# EAGLE design Gateway_v1.0 (EAGLE 9.3.0)

## Sheet 1 of 2
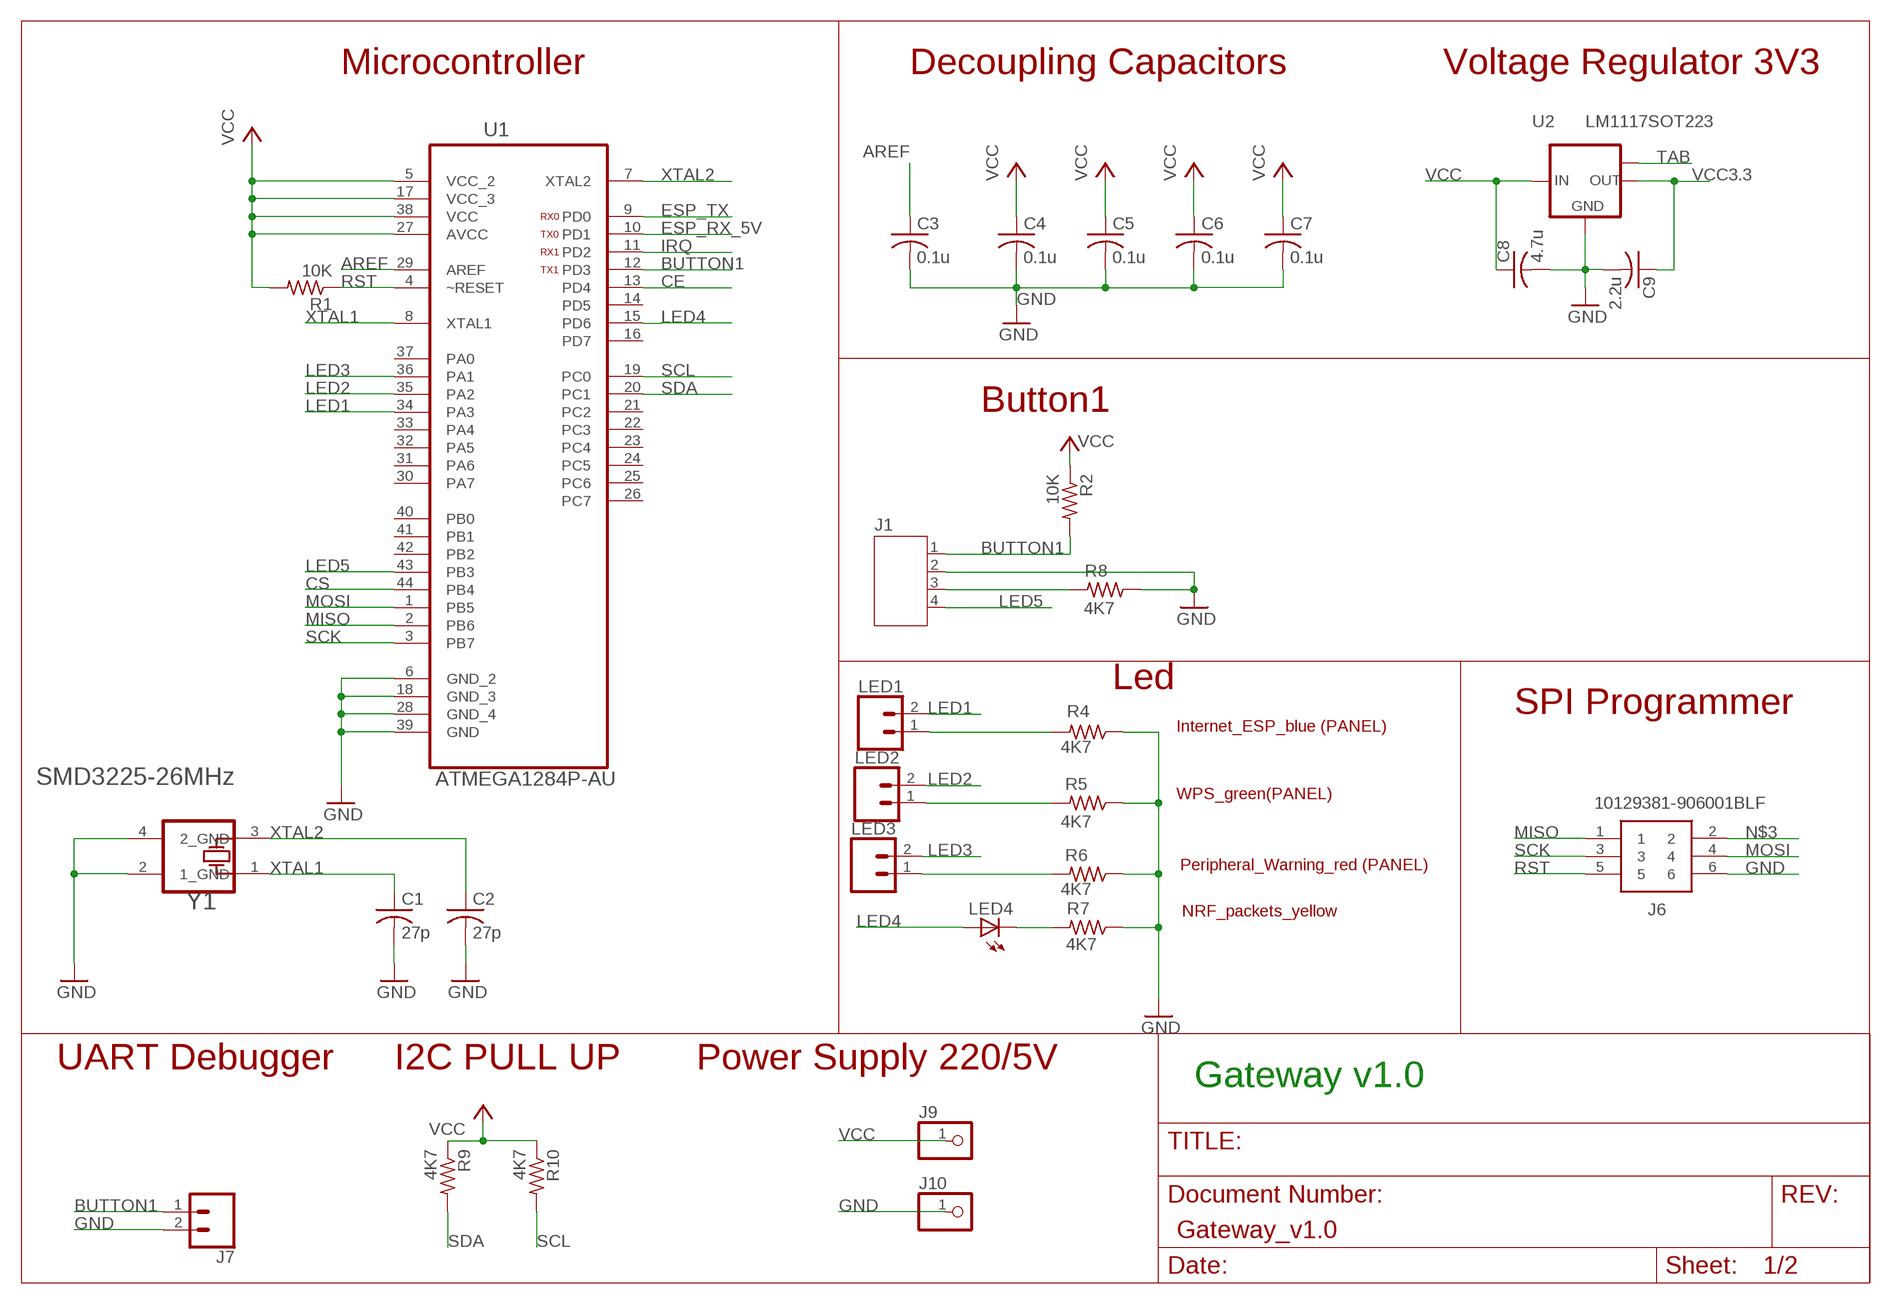
[diagram p0: schematic, sheet 1]

### Parts
C1  27p  CAPACITOR-SMD-0805  [SMD-0805]
C2  27p  CAPACITOR-SMD-0805  [SMD-0805]
C3  0.1u  CAPACITOR-SMD-0805  [SMD-0805]
C4  0.1u  CAPACITOR-SMD-0805  [SMD-0805]
C5  0.1u  CAPACITOR-SMD-0805  [SMD-0805]
C6  0.1u  CAPACITOR-SMD-0805  [SMD-0805]
C7  0.1u  CAPACITOR-SMD-0805  [SMD-0805]
C8  4.7u  CAPACITOR-SMD-0805  [SMD-0805]
C9  2.2u  CAPACITOR-SMD-0805  [SMD-0805]
J1  JST-PH4  [JST-PH4]
J6  10129381-906001BLF  [HDRV6W67P254_2X3_762X483X858P]
J7  CONN_02  [1X02]
J9  PINHD-1X1CB  [1X01-CLEANBIG]
J10  PINHD-1X1CB  [1X01-CLEANBIG]
LED1  CONN_02  [1X02]
LED2  CONN_02  [1X02]
LED3  CONN_02  [1X02]
LED4  LED4  LED-SMD-0805  [SMD-0805-LED]
R1  10K  RESISTOR-SMD-0805  [SMD-0805]
R2  10K  RESISTOR-SMD-0805  [SMD-0805]
R4  4K7  RESISTOR-SMD-0805  [SMD-0805]
R5  4K7  RESISTOR-SMD-0805  [SMD-0805]
R6  4K7  RESISTOR-SMD-0805  [SMD-0805]
R7  4K7  RESISTOR-SMD-0805  [SMD-0805]
R8  4K7  RESISTOR-SMD-0805  [SMD-0805]
R9  4K7  RESISTOR-SMD-0805  [SMD-0805]
R10  4K7  RESISTOR-SMD-0805  [SMD-0805]
U1  ATMEGA1284P-AU  [QFP80P1200X1200X120-44N]
U2  LM1117SOT223  LM1117MPX-3.3  [SOT223]
Y1  TND_ELECTRONIC_SMD3225-26MHZTND_ELECTRONIC_SMD3225-26MHZ_0_0  [TND_ELECTRONIC_SMD3225-26MHZ_0]

### Nets
AREF: C3.1 U1.29(AREF)
BUTTON1: J1.1 J7.1 R2.2 U1.12(PD3)
CE: U1.13(PD4) ; also sheet 2
CS: U1.44(PB4) ; also sheet 2
ESP_RX_5V: U1.10(PD1) ; also sheet 2
ESP_TX: U1.9(PD0) ; also sheet 2
GND: C1.2 C2.2 C3.2 C4.2 C5.2 C6.2 C7.2 C8.2 C9.2 J1.2 J6.6 J7.2 J10.1 R4.1 R5.1 R6.1 R7.1 R8.1 U1.6(GND_2) U1.18(GND_3) U1.28(GND_4) U1.39(GND) U2.1(GND) Y1.2(1_GND) Y1.4(2_GND) ; also sheet 2
IRQ: U1.11(PD2) ; also sheet 2
LED1: LED1.2 U1.34(PA3)
LED2: LED2.2 U1.35(PA2)
LED3: LED3.2 U1.36(PA1)
LED4: LED4.1(A) U1.15(PD6)
LED5: J1.4 U1.43(PB3)
MISO: J6.1 U1.2(PB6) ; also sheet 2
MOSI: J6.4 U1.1(PB5) ; also sheet 2
N$1: LED2.1 R5.2
N$2: LED3.1 R6.2
N$3: J6.2
N$4: LED1.1 R4.2
N$8: J1.3 R8.2
N$12: LED4.2(C) R7.2
RST: J6.5 R1.1 U1.4(~RESET)
SCK: J6.3 U1.3(PB7) ; also sheet 2
SCL: R10.2 U1.19(PC0) ; also sheet 2
SDA: R9.2 U1.20(PC1) ; also sheet 2
VCC: C4.1 C5.1 C6.1 C7.1 C8.1 J9.1 R1.2 R2.1 R9.1 R10.1 U1.5(VCC_2) U1.17(VCC_3) U1.27(AVCC) U1.38(VCC) U2.3(IN) ; also sheet 2
VCC3.3: C9.1 U2.2(OUT) ; also sheet 2
XTAL1: C1.1 U1.8(XTAL1) Y1.1(X1)
XTAL2: C2.1 U1.7(XTAL2) Y1.3(X2)
ΤΑΒ: U2.TAB(OUT1)
Unconnected: U1.14(PD5) U1.16(PD7) U1.21(PC2) U1.22(PC3) U1.23(PC4) U1.24(PC5) U1.25(PC6) U1.26(PC7) U1.30(PA7) U1.31(PA6) U1.32(PA5) U1.33(PA4) U1.37(PA0) U1.40(PB0) U1.41(PB1) U1.42(PB2)

### Notes on the sheet
- Microcontroller | Decoupling Capacitors | Voltage Regulator 3V3
- RX0
- TX0
- RX1
- TX1
- Button1
- Led
- SPI Programmer
- Internet_ESP_blue (PANEL)
- WPS_green(PANEL)
- Peripheral_Warning_red (PANEL)
- NRF_packets_yellow
- UART Debugger | I2C PULL UP | Power Supply 220/5V
- Gateway v1.0

## Sheet 2 of 2
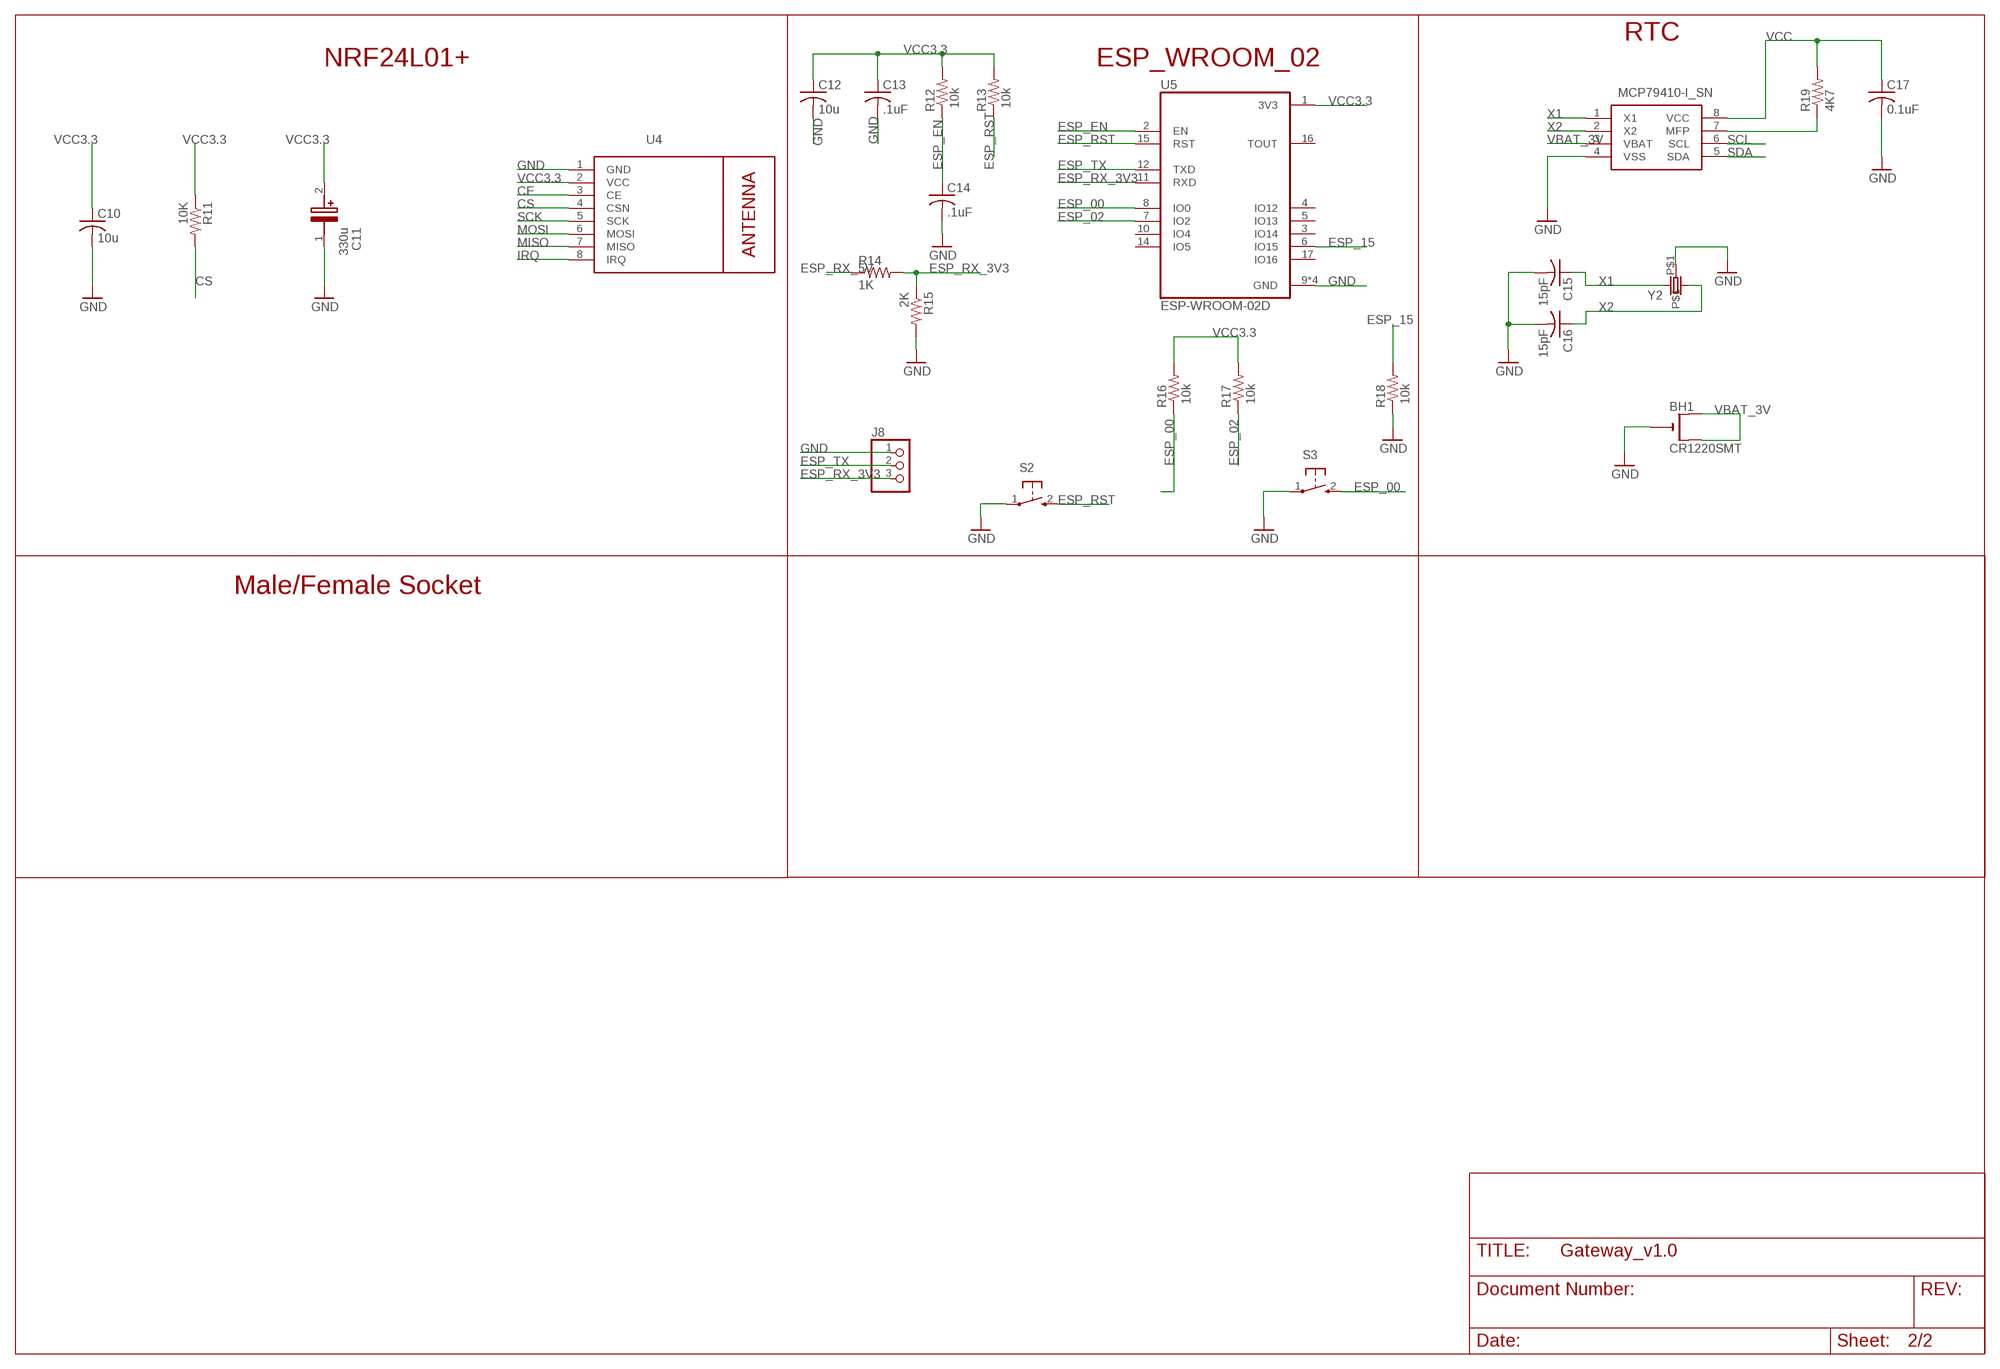
[diagram p1: schematic, sheet 2]

### Parts
BH1  CR1220SMT  [CR1220-SMD]
C10  10u  CAPACITOR-SMD-0805  [SMD-0805]
C11  330u  EEE-FNC271XUP  [SMD_LYTIC_D8]
C12  10u  CAPACITOR-SMD-0805  [SMD-0805]
C13  .1uF  CAPACITOR-SMD-0805  [SMD-0805]
C14  .1uF  CAPACITOR-SMD-0805  [SMD-0805]
C15  15pF  CAPACITOR-SMD-0805  [SMD-0805]
C16  15pF  CAPACITOR-SMD-0805  [SMD-0805]
C17  0.1uF  CAPACITOR-SMD-0805  [SMD-0805]
J8  PINHD-1X3  [1X03]
R11  10K  RESISTOR-SMD-0805  [SMD-0805]
R12  10k  RESISTOR-SMD-0805  [SMD-0805]
R13  10k  RESISTOR-SMD-0805  [SMD-0805]
R14  1K  RESISTOR-SMD-0805  [SMD-0805]
R15  2K  RESISTOR-SMD-0805  [SMD-0805]
R16  10k  RESISTOR-SMD-0805  [SMD-0805]
R17  10k  RESISTOR-SMD-0805  [SMD-0805]
R18  10k  RESISTOR-SMD-0805  [SMD-0805]
R19  4K7  RESISTOR-SMD-0805  [SMD-0805]
S2  SPST_TACT-KMR2  [KMR2]
S3  SPST_TACT-KMR2  [KMR2]
U4  WIRELESS-NRF24L01  [WIRELESS-NRF24L01]
U5  ESP-WROOM-02D  [MODULE_ESP-WROOM-02D]
U6  MCP79410-I_SN  [SOIC127P600X175-8N]
Y2  CRYSTALTC26H  [TC26H]

### Nets
CE: U4.3(CE) ; also sheet 1
CS: R11.2 U4.4(CSN) ; also sheet 1
ESP_00: R16.1 S3.2(S) U5.8(IO0)
ESP_02: R17.1 U5.7(IO2)
ESP_15: R18.2 U5.6(IO15)
ESP_EN: C14.1 R12.1 U5.2(EN)
ESP_RST: R13.1 S2.2(S) U5.15(RST)
ESP_RX_3V3: J8.3 R14.2 R15.1 U5.11(RXD)
ESP_RX_5V: R14.1 ; also sheet 1
ESP_TX: J8.2 U5.12(TXD) ; also sheet 1
GND: BH1.- C10.2 C11.1 C12.2 C13.2 C14.2 C15.2 C16.2 C17.2 J8.1 R15.2 R18.1 S2.1(P) S3.1(P) U4.1(GND) U5.9(GND) U5.13(GND) U5.18(GND) U5.19(GND) U6.4(VSS) Y2.P$1 ; also sheet 1
IRQ: U4.8(IRQ) ; also sheet 1
MISO: U4.7(MISO) ; also sheet 1
MOSI: U4.6(MOSI) ; also sheet 1
N$16: R19.1 U6.7(MFP)
SCK: U4.5(SCK) ; also sheet 1
SCL: U6.6(SCL) ; also sheet 1
SDA: U6.5(SDA) ; also sheet 1
VBAT_3V: BH1.+$1(+) BH1.+$2(+1) U6.3(VBAT)
VCC: C17.1 R19.2 U6.8(VCC) ; also sheet 1
VCC3.3: C10.1 C11.2 C12.1 C13.1 R11.1 R12.2 R13.2 R16.2 R17.2 U4.2(VCC) U5.1(3V3) ; also sheet 1
X1: C15.1 U6.1(X1) Y2.2
X2: C16.1 U6.2(X2) Y2.1
Unconnected: U5.3(IO14) U5.4(IO12) U5.5(IO13) U5.10(IO4) U5.14(IO5) U5.16(TOUT) U5.17(IO16)

### Notes on the sheet
- RTC
- NRF24L01+ | ESP_WROOM_02
- Male/Female Socket

## Library data of the parts
BH1 = CR1220:CR1220: CR1216/CR1220/CR1225 12mm 3V lithium coin cell Great for battery packup. Both SMT and THM holders. Note the THM package has the ground pads on both sides of the PCB so that the masks are the same - this reduces the cost Check prices <https://pricing.snapeda.com/parts/CR1220/FDK%20America%2C/view-part?ref=eda>; AVAILABILITY: In Stock; DESCRIPTION: Button cell battery, Lithium, 3 V, 35 mAh | VARTA CR1220 (Button cell battery, Lithium, 3 V, 35 mAh Standard Batteries).; MF: FDK America,; MP: CR1220; PACKAGE: Varta; PRICE: None
C1-C10 C12-C17 = Fuzzy:CAPACITOR-SMD-0805
C11 = SamacSys_Parts:EEE-FNC271XUP: PANASONIC - EEE-FNC271XUP - CAP, 270UF, 16V, ALU ELEC, SMD Source: Datasheet <http://industrial.panasonic.com/cdbs/www-data/pdf/RDE0000/RDE0000C1259.pdf>; DESCRIPTION: PANASONIC - EEE-FNC271XUP - CAP, 270UF, 16V, ALU ELEC, SMD; HEIGHT: 7.8mm; MANUFACTURER_NAME: Panasonic; MANUFACTURER_PART_NUMBER: EEE-FNC271XUP; MOUSER_PART_NUMBER: 667-EEE-FNC271XUP; MOUSER_PRICE-STOCK: https://www.mouser.co.uk/ProductDetail/Panasonic/EEE-FNC271XUP?qs=OlC7AqGiEDk4Wtbs6TVCqQ%3D%3D
J1 = jst-ph:JST-PH4
J6 = SamacSys_Parts:10129381-906001BLF: HEADER DR VT TH 2X3 Source: Datasheet <https://cdn.amphenol-icc.com/media/wysiwyg/files/drawing/10129381.pdf>; DESCRIPTION: HEADER DR VT TH 2X3; HEIGHT: 8.58mm; MANUFACTURER_NAME: Amphenol; MANUFACTURER_PART_NUMBER: 10129381-906001BLF; MOUSER_PART_NUMBER: 649-1012938190601BLF; MOUSER_PRICE-STOCK: https://www.mouser.co.uk/ProductDetail/Amphenol-FCI/10129381-906001BLF?qs=0lQeLiL1qyZMxGRnx95Mzg%3D%3D
J7 LED1-LED3 = SparkFun-Connectors:CONN_02: Multi connection point. Often used as Generic Header-pin footprint for 0.1 inch spaced/style header connections On any of the 0.1 inch spaced packages, you can populate with these: Break Away Headers - Straight <https://www.sparkfun.com/products/116> (PRT-00116) Break Away Male Headers - Right Angle <https://www.sparkfun.com/products/553> (PRT-00553) Female Headers <https://www.sparkfun.com/products/115> (PRT-00115) Break Away Headers - Machine Pin <https://www.sparkfun.com/products/117> (PRT-00117) Break Away Female Headers - Swiss Machine Pin <https://www.sparkfun.com/products/743> (PRT-00743) For SCREWTERMINALS and SPRING TERMINALS visit here: Screw Terimnals on SparkFun.com <https://www.sparkfun.com/search/results?term=Screw+Terminals> (5mm/3.5mm/2.54mm spacing) This device is also useful as a general connection point to wire up your design to another part of your project. Our various solder wires solder well into these plated through hole pads. Hook-Up Wire - Assortment (Stranded, 22 AWG) <https://www.sparkfun.com/products/11375> (PRT-11375) Hook-Up Wire - Assortment (Solid Core, 22 AWG) <https://www.sparkfun.com/products/11367> (PRT-11367) View the entire wire category on our website here <https://www.sparkfun.com/categories/141> Special notes: Molex polarized connector foot print use with: PRT-08233 with associated crimp pins and housings. 2.54_SCREWTERM for use with PRT-10571. 3.5mm Screw Terminal footprints for PRT-08084 5mm Screw Terminal footprints for use with PRT-08432
J8 = adafruit:PINHD-1X3: PIN HEADER
J9 J10 = adafruit:PINHD-1X1: Pin header 1x1 for 0.1" spacing With round pins
LED4 = Fuzzy:LED-SMD-0805
R1 R2 R4-R19 = Fuzzy:RESISTOR-SMD-0805
S2 S3 = TS-1096S-A2B2-C1D2:SPST_TACT: SMT 6mm switch, EVQQ2 series http://www.ladyada.net/library/eagle
U1 = ATMEGA1284P-AU:ATMEGA1284P-AU: Microcontroller with Programmable Flash; AVAILABILITY: Unavailable; DESCRIPTION: MCU 8-Bit ATmega AVR RISC 128KB Flash 2.5V/3.3V/5V 44-Pin TQFP; MF: Microchip; MP: ATMEGA1284P-AU; PACKAGE: TQFP-44 Microchip; PRICE: None
U2 = lm1117:LM1117MPX-*
U4 = diy-modules:WIRELESS-NRF24L01: 2.4 GHz Wireless Module based on NRF24L01 chip More details available here: http://www.electrodragon.com/w/NRF24L01 Click here to find device on ebay.com <http://www.ebay.com/sch/nrf24l01+arduino>
U5 = ESP-WROOM-02D:ESP-WROOM-02D: WiFi 802.11b/g/n Transceiver Module 2.4GHz ~ 2.5GHz Integrated, Trace Surface Mount Check prices <https://pricing.snapeda.com/parts/ESP-WROOM-02D/Espressif%20Systems/view-part?ref=eda>; AVAILABILITY: In Stock; DESCRIPTION: WiFi 802.11b/g/n Transceiver Module 2.4GHz ~ 2.5GHz Integrated, Trace Surface Mount; MF: Espressif Systems; MP: ESP-WROOM-02D; PACKAGE: SMD-18 Espressif Systems; PRICE: None; PURCHASE-URL: https://pricing.snapeda.com/search/part/ESP-WROOM-02D/?ref=eda
U6 = SamacSys_Parts:MCP79410-I_SN: I2C GP RTCC, 1Kb EE, 64B SRAM, ID Source: Datasheet <https://componentsearchengine.com/Datasheets/1/MCP79410-I_SN.pdf>; DESCRIPTION: I2C GP RTCC, 1Kb EE, 64B SRAM, ID; HEIGHT: 1.75mm; MANUFACTURER_NAME: Microchip; MANUFACTURER_PART_NUMBER: MCP79410-I/SN; MOUSER_PART_NUMBER: 579-MCP79410-I/SN; MOUSER_PRICE-STOCK: https://www.mouser.com/Search/Refine.aspx?Keyword=579-MCP79410-I%2FSN
Y1 = TND Electronic - SMD3225-26MHz:TND_ELECTRONIC_SMD3225-26MHZ: TXTF-XTAL_1-3-4; ADJUSTMENT_TOLERANCE_MAX: +/- 20 ppm; CIIVA_IDS: 21167266; COMPONENT_LINK_1_DESCRIPTION: Manufacturer URL; COMPONENT_LINK_1_URL: http://www.txtianfeng.cn/; DATASHEET_VERSION: Dec-13; EQUIVALENT_SERIES_RESISTANCE_AT_25_DEGC_MAX: 50 Ohm; FOOTPRINT_VARIANT_NAME_0: Manufacturer Recommended; IMPORTED: yes; IMPORTED_FROM: vault; IMPORT_TS: 1521862708; LOAD_CAPACITANCE: 15 pF; MF: TND Electronic; MOUNTING_TECHNOLOGY: Surface Mount; MPN: SMD3225-26MHz; NOMINAL_FREQUENCY: 26 MHz; OPERATING_TEMPERATURE_RANGE: -20 to 70 degC; PACKAGE: SMD3225-4; PACKAGE_DESCRIPTION: 4-Pin Surface Mount Crystal, Body 2.5 x 3.2 mm, Height 0.7 mm; PREFIX: X; RELEASE_DATE: 1387507933; SHUNT_CAPACITANCE_MAX: 3.5 pF; TOLERANCE_OVER_THE_TEMPERATURE_RANGE_MAX: +/- 20 ppm; VAULT_GUID: 2DF3794C-1672-4F1A-ABBC-3B8CD58D4AF4; VAULT_REVISION: 393B1630-2FB9-4E5C-9BF1-9404DCAA7C1D
Y2 = adafruit:CRYSTAL: CRYSTAL; OC_FARNELL: unknown; OC_NEWARK: unknown

## Net classes
0 default: width 0.254 mm, drill 0.508 mm, clearance 0.203 mm
1 ACnet: width 1.778 mm, drill 0.508 mm, clearance 0.203 mm

## Board
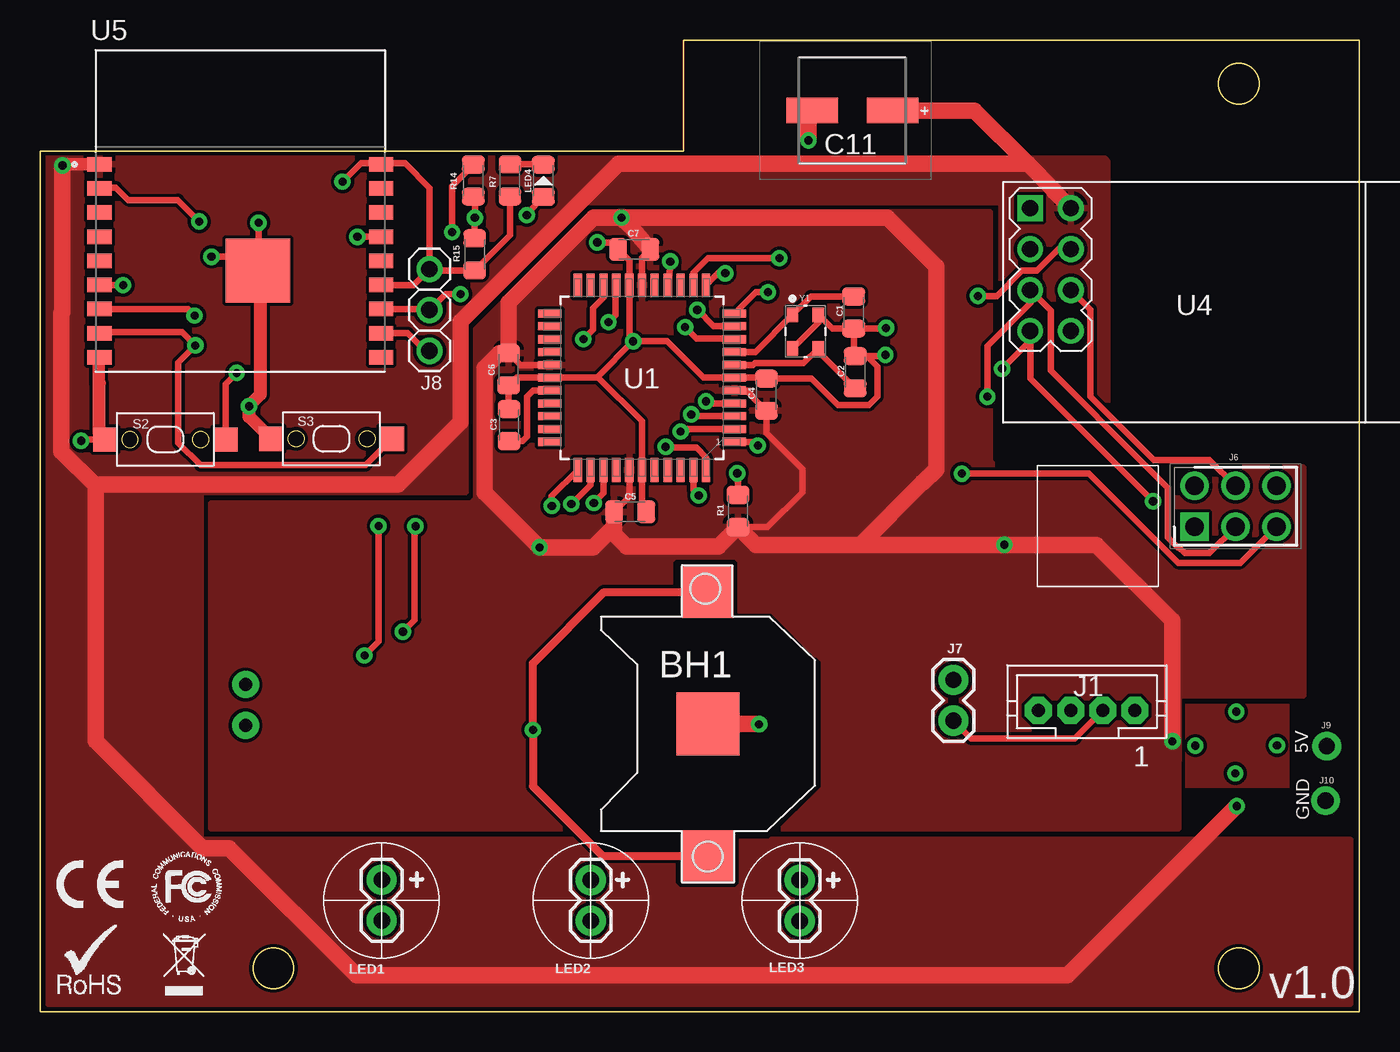
[diagram p2: board, top side]
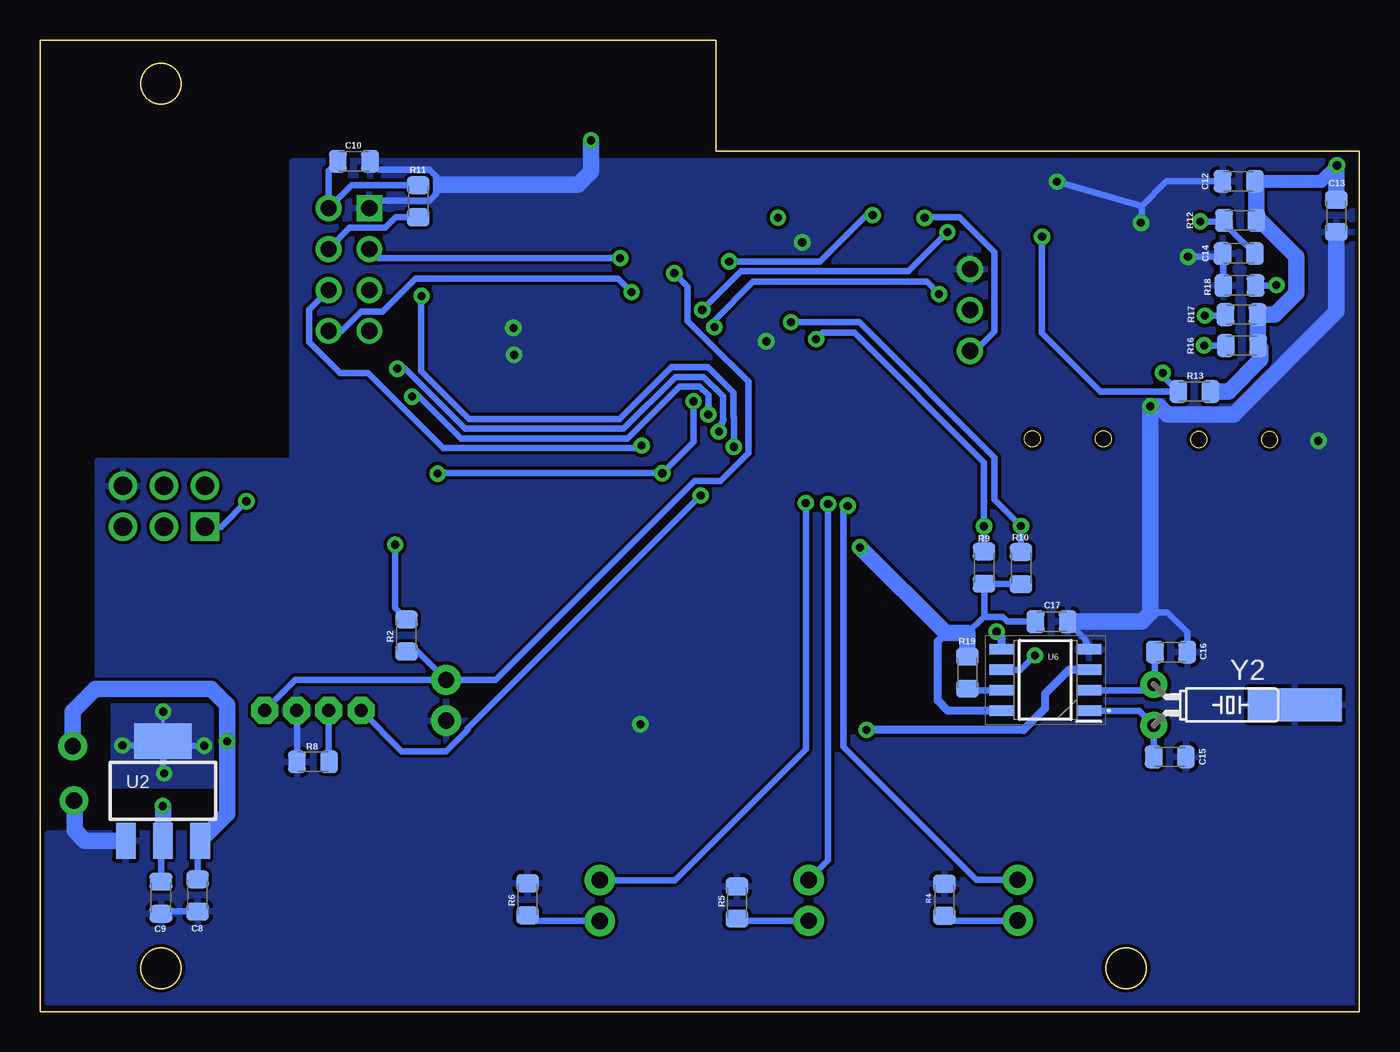
[diagram p3: board, bottom side, seen from below]

Size 82 x 60.4 mm. Coordinates in mm from the lower left corner, seen from the top.
Outline: 0,0 82,0 82,60.4 40,60.4 40,53.5 0,53.5 0,0
Outline: circle at 74.5,2.7 radius 1.25
Outline: circle at 14.5,2.7 radius 1.25
Outline: circle at 74.5,57.7 radius 1.25
Copper layers (1*16): Top 0.035mm / dielectric 1.5mm / Bottom 0.035mm
Design rules "SparkFun": minimum track width 8mil, minimum drill 20mil, track to track 8mil, track to pad 8mil, pad to pad 8mil, via to via 8mil, smd to smd 8mil, copper to edge 8mil, drill to drill 8mil, minimum pad ring 12mil, minimum via ring 10mil, stop-mask expansion 4mil, vias tented up to drill 20mil, thermal gap 10mil

### Footprints (pad centres in the part's own frame; a part is rotated, then mirrored left to right if it is on the bottom)
CR1220-SMD = smd 3.2 x 3.2: +$1 -8.2,0; +$2 8.2,0 | smd 3.9 x 3.9: - 0,0
SMD-0805 = smd 1.1 x 1.4: 1 -1,0; 2 1,0
SMD_LYTIC_D8 = smd 3.2 x 1.6: 1 -2.5,0; 2 2.5,0
JST-PH4 = drill 0.813 pad 1.676 octagon: 1 3,0; 2 1,0; 3 -1,0; 4 -3,0
HDRV6W67P254_2X3_762X483X858P = drill 1.15 pad 1.725 square: 1 0,0 | drill 1.15 pad 1.725: 2 0,2.54; 3 2.54,0; 4 2.54,2.54; 5 5.08,0; 6 5.08,2.54
1X02 = drill 1.016 pad 1.88: 1 0,0; 2 2.54,0
1X03 = drill 1.016: 1 -2.54,0; 2 0,0; 3 2.54,0
1X01-CLEANBIG = drill 1.016 pad 1.778: 1 0,0
SMD-0805-LED = smd 1.1 x 1.4: 1 -1,0; 2 1,0
KMR2 = smd 1.5 x 1.5: 1 -3.75,0; 2 3.75,0
QFP80P1200X1200X120-44N = smd 1.473 x 0.508: 1 -5.74,3.988; 2 -5.74,3.2; 3 -5.74,2.388; 4 -5.74,1.6; 5 -5.74,0.787; 6 -5.74,0; 7 -5.74,-0.787; 8 -5.74,-1.6; 9 -5.74,-2.388; 10 -5.74,-3.2; 11 -5.74,-3.988; 23 5.74,-3.988; 24 5.74,-3.2; 25 5.74,-2.388; 26 5.74,-1.6; 27 5.74,-0.787; 28 5.74,0; 29 5.74,0.787; 30 5.74,1.6; 31 5.74,2.388; 32 5.74,3.2; 33 5.74,3.988 | smd 0.508 x 1.473: 12 -3.988,-5.74; 13 -3.2,-5.74; 14 -2.388,-5.74; 15 -1.6,-5.74; 16 -0.787,-5.74; 17 0,-5.74; 18 0.787,-5.74; 19 1.6,-5.74; 20 2.388,-5.74; 21 3.2,-5.74; 22 3.988,-5.74; 34 3.988,5.74; 35 3.2,5.74; 36 2.388,5.74; 37 1.6,5.74; 38 0.787,5.74; 39 0,5.74; 40 -0.787,5.74; 41 -1.6,5.74; 42 -2.388,5.74; 43 -3.2,5.74; 44 -3.988,5.74
SOT223 = smd 1.219 x 2.235: 1 -2.311,-3.099; 2 0,-3.099; 3 2.311,-3.099 | smd 3.6 x 2.2: TAB 0,3.099
WIRELESS-NRF24L01 = drill 1 square: 1 -12.7,6.35 | drill 1: 2 -10.16,6.35; 3 -12.7,3.81; 4 -10.16,3.81; 5 -12.7,1.27; 6 -10.16,1.27; 7 -12.7,-1.27; 8 -10.16,-1.27
MODULE_ESP-WROOM-02D = smd 1.5 x 0.9: 1 -8.75,2.9; 2 -8.75,1.4; 3 -8.75,-0.1; 4 -8.75,-1.6; 5 -8.75,-3.1; 6 -8.75,-4.6; 7 -8.75,-6.1; 8 -8.75,-7.6; 9 -8.75,-9.1; 10 8.75,-9.1; 11 8.75,-7.6; 12 8.75,-6.1; 13 8.75,-4.6; 14 8.75,-3.1; 15 8.75,-1.6; 16 8.75,-0.1; 17 8.75,1.4; 18 8.75,2.9 | smd 4 x 4: 19 1.1,-3.71
SOIC127P600X175-8N = smd 1.525 x 0.65: 1 -2.712,1.905; 2 -2.712,0.635; 3 -2.712,-0.635; 4 -2.712,-1.905; 5 2.712,-1.905; 6 2.712,-0.635; 7 2.712,0.635; 8 2.712,1.905
TND_ELECTRONIC_SMD3225-26MHZ_0 = smd 0.7 x 0.9: 1 -0.8,1.05; 2 -0.8,-1.05; 3 0.8,-1.05; 4 0.8,1.05
TC26H = drill 0.813 pad 1.676: 1 -1.27,0; 2 1.27,0 | smd 2.032 x 5.842: P$1 0,8.763

### Placement (x,y rotation side)
BH1  41.51,17.89 90 top
C1  50.57,43.47 270 top
C2  50.66,39.76 90 top
C3  29.15,36.47 90 top
C4  45.14,38.36 90 top
C5  36.67,31.08 0 top
C6  29.12,39.94 270 top
C7  36.92,47.4 180 top
C8  72.22,7.23 270 bottom
C9  74.49,7.09 270 bottom
C10  62.5,52.87 0 bottom
C11  50.48,56.03 0 top
C12  7.5,51.63 180 bottom
C13  1.43,49.48 270 bottom
C14  7.49,47.14 180 bottom
C15  11.78,15.84 0 bottom
C16  11.7,22.36 0 bottom
C17  19.13,24.25 0 bottom
J1  65.06,18.73 0 top
J6  71.77,30.15 0 top
J7  56.77,20.63 270 top
J8  24.2,43.63 270 top
J9  79.98,16.5 0 top
J10  79.91,13.13 0 top
LED1  21.23,5.66 90 top
LED2  34.23,5.65 90 top
LED3  47.22,5.64 90 top
LED4  31.28,51.66 90 top
R1  43.38,31.13 270 top
R2  59.23,23.39 270 bottom
R4  25.79,6.96 270 bottom
R5  38.69,6.79 270 bottom
R6  51.7,6.99 270 bottom
R7  29.2,51.68 90 top
R8  65.04,15.54 0 bottom
R9  23.33,27.61 90 bottom
R10  21.03,27.58 90 bottom
R11  58.5,50.39 270 bottom
R12  7.41,49.2 0 bottom
R13  10.25,38.55 0 bottom
R14  26.93,51.67 270 top
R15  27.01,47.09 270 top
R16  7.29,41.41 0 bottom
R17  7.32,43.34 0 bottom
R18  7.45,45.15 0 bottom
R19  24.36,21.08 90 bottom
S2  7.78,35.58 0 top
S3  18.11,35.62 0 top
U1  37.41,39.42 180 top
U2  74.37,13.73 0 bottom
U4  74.24,43.6 0 top
U5  12.44,49.78 0 top
U6  19.52,20.62 180 bottom
Y1  47.57,42.29 0 top
Y2  12.77,19.07 270 bottom

### Tracks (layer width: path | path; a pad name or v marks a point on that pad's centre or on a via)
AREF
  Top 0.406: U1.29 30.64,38.63 30.26,38.25 30.26,35.75 29.98,35.47 C3.1
BUTTON1  (via drill 0.51)
  Top 0.406: v42.58,45.91 42.14,45.91 U1.12
  Bottom 0.406: v42.58,45.91 41.76,45.09 41.76,42.94 40.47,41.65 40.45,41.65 37.97,39.17 37.97,34.75 39.71,33 41.32,33 53.69,20.63 J7.1 | J1.1 66.16,20.63 J7.1 | R2.2 58.53,22.39 J7.1
CE  (via drill 0.51)
  Top 0.406: v45.95,46.85 41.52,46.85 40.61,45.94 U1.13
  Bottom 0.406: v45.95,46.85 60.98,46.85 U4.3
CS  (via drill 0.51)
  Top 0.406: v38.88,35.13 38.94,35.07 40.79,35.07 41.4,34.46 U1.44 | v58.29,44.5 59.46,44.5 61.04,46.08 61.97,46.08 63.3,47.41 U4.4
  Bottom 0.406: v38.88,35.13 38.88,36.95 38.91,36.98 38.91,38.49 40.5,40.08 42.76,40.08 45.98,36.86 55.34,36.86 58.31,39.82 58.31,44.48 v58.29,44.5 | R11.2 59.92,49.39 60.57,48.74 62.75,48.74 U4.4
ESP_00  (via drill 0.51)
  Top 0.406: S3.2 20.22,33.98 9.96,33.98 8.59,35.35 8.59,40.37 v9.64,41.42 8.82,42.24 3.74,42.24 U5.8
  Bottom 0.406: v9.64,41.42 v9.63,41.41 R16.1
ESP_02  (via drill 0.51)
  Top 0.406: v9.59,43.28 9.19,43.68 U5.7
  Bottom 0.406: v9.59,43.28 8.38,43.28 R17.1
ESP_15  (via drill 0.51)
  Top 0.406: U5.6 v5.15,45.17
  Bottom 0.406: R18.2 5.17,45.15 v5.15,45.17
ESP_EN  (via drill 0.51)
  Top 0.406: v9.88,49.13 8.55,50.46 5.48,50.46 4.7,51.24 3.74,51.24 U5.2
  Bottom 0.406: v9.88,49.13 8.11,49.13 8.07,49.17 | R12.1 8.25,49.35 8.07,49.17 | C14.1 8.04,48.66 8.04,49.14 8.07,49.17
ESP_RST  (via drill 0.51)
  Top 0.406: v12.21,39.71 11.53,39.03 S2.2 | v19.72,48.18 U5.15
  Bottom 0.406: v19.72,48.18 19.72,42.18 16.09,38.55 R13.1 12.21,39.51 v12.21,39.71
ESP_RX_3V3  (via drill 0.51)
  Top 0.406: J8.3 23.94,41.09 22.85,42.18 U5.11 | R15.1 v27.01,49.35 v27.02,49.36 27.02,50.58 R14.2
  Bottom 0.406: J8.3 23.87,41.09 22.68,42.28 22.68,47.21 24.86,49.39 26.99,49.39 v27.02,49.36
ESP_RX_5V  (via drill 0.51)
  Top 0.406: v40.85,43.64 41.87,42.62 U1.10 | v25.6,48.47 25.6,51.34 R14.1
  Bottom 0.406: v40.85,43.64 40.82,43.64 38.44,46.03 28.04,46.03 v25.6,48.47
ESP_TX  (via drill 0.51)
  Top 0.406: U1.9 43.1,41.86 40.79,41.86 v40.09,42.56 | v26.12,44.62 25.19,44.62 J8.2 24.09,43.74 24.03,43.68 U5.12
  Bottom 0.406: v26.12,44.62 26.89,45.38 37.69,45.38 40.09,42.98 v40.09,42.56
GND  (via drill 0.51)
  Top 0.406: J8.1 24.28,46.09 R15.2 29.2,48.28 R7.1 | C5.2 37.41,31.34 U1.39 37.41,36.71 34.65,39.47 | C3.2 29.12,37.5 C6.2 29.6,39.42 U1.28 34.6,39.42 34.65,39.47 | v18.79,51.61 19.95,52.77 21.1,52.77 U5.18 21.24,52.74 22.67,52.74 24.2,51.21 J8.1 | 34.65,39.47 v36.86,41.68 | v36.86,41.68 36.62,41.92 U1.18 36.62,46.7 C7.2 35.49,47.83 v34.63,47.83 | C1.2 50.59,42.45 50.59,40.83 C2.2 | Y1.2 48.37,42.84 Y1.4 49.24,42.47 C1.2 | C2.2 51.4,40.76 52.04,40.12 52.04,38.24 51.53,37.73 49.58,37.73 47.95,39.36 C4.2 45.08,39.42 U1.6 41.22,39.42 38.96,41.68 v36.86,41.68 | S2.1 2.63,35.58 v2.54,35.49 | J7.2 57.87,16.99 64.32,16.99 J1.2 | C1.2 52.54,42.47 v52.58,42.51 | C2.2 52.46,40.76 v52.54,40.84 | U5.13 23.21,45.18 J8.1 | v13.57,49.05 13.57,46.84 | 13.57,46.84 13.57,46.11 U5.19 13.68,46.22 13.68,46.42 | v10.65,46.94 13.47,46.94 13.57,46.84
  Top 0.762: 3.65,39.09 3.65,40.65 U5.9
  Top 0.813: 3.65,39.09 3.68,39.06 3.68,35.93 S2.1 | 13.68,46.42 13.68,38.38 12.98,37.68 v12.98,37.64 12.98,37 S3.1
  Top 1.016: BH1.- 44.67,17.89 v44.69,17.87 | v47.76,54.17 47.76,55.81 C11.1
  Bottom 0.406: C12.2 11.98,51.63 13.53,50.08 | U6.4 17.06,23.18 C17.2 | v18.79,51.61 13.53,50.08 | R18.1 8.45,47.1 C14.2 8.7,46.94 v10.65,46.94 | C10.2 60.98,52.35 57.79,52.35 57.39,51.95 57.39,50.83 57.79,50.43 61.06,50.43 U4.1 | C9.2 74.35,6.23 C8.2 | R8.1 66.04,18.71 J1.2 | C16.2 10.7,23.6 11.92,24.82 12.98,24.82 | 13.53,50.08 13.53,49.1 v13.57,49.05
  Bottom 1.016: C13.2 1.43,43.52 7.81,37.14 11.93,37.14 12.43,37.64 v12.98,37.64 12.98,24.82 12.97,24.81 13.53,24.25 C17.2 | J10.1 79.86,13.08 79.86,11.26 79.23,10.63 U2.1 | 57.09,51.41 48.57,51.41 47.76,52.22 v47.76,54.17
  pour Bottom: 0.37,52.89 66.3,52.89 66.3,34.29 66.26,34.25 78.42,34.25 78.43,34.24 78.43,19.94 70.6,19.94 70.6,11.08 81.51,11.08 81.52,11.09 81.57,0.58 0.36,0.58 0.36,52.9
IRQ  (via drill 0.51)
  Top 0.406: U1.11 44.48,44.74 v45.24,44.74
  Bottom 0.406: v45.24,44.74 46.09,45.59 58.67,45.59 60.72,43.54 62.04,43.54 63.25,42.33 U4.8
LED1  (via drill 0.51)
  Top 0.406: U1.34 31.8,32.06 v31.8,31.45
  Bottom 0.406: v31.8,31.45 32.06,31.19 32.06,16.45 23.81,8.2 LED1.2
LED2  (via drill 0.51)
  Top 0.406: U1.35 34.21,32.75 v33.02,31.56
  Bottom 0.406: v33.02,31.56 33.02,9.4 LED2.2
LED3  (via drill 0.51)
  Top 0.406: U1.36 35.02,32.24 v34.41,31.63
  Bottom 0.406: v34.41,31.63 34.41,16.31 42.54,8.18 LED3.2
LED4  (via drill 0.51)
  Top 0.406: U1.15 39.06,45.21 v39.17,46.64 | LED4.1 30.25,49.63 v30.25,49.52
  Bottom 0.406: v39.17,46.64 33.52,46.64 30.64,49.52 v30.25,49.52
LED5  (via drill 0.51)
  Top 0.406: U1.43 40.61,32.42 v40.94,32.09
  Bottom 0.406: v40.94,32.09 55.42,17.61 55.42,17.53 56.77,16.19 59.52,16.19 J1.4
MISO  (via drill 0.51)
  Top 0.406: v39.81,36.07 39.96,36.22 U1.2 | v59.8,39.98 61.54,41.72 U4.7 61.54,39.38 v69.19,31.73
  Bottom 0.406: v39.81,36.07 39.52,36.85 39.56,36.89 39.56,38.27 40.75,39.47 42.51,39.47 45.73,36.25 55.6,36.25 59.32,39.98 v59.8,39.98 | v69.19,31.73 70.77,30.15 J6.1
MOSI  (via drill 0.51)
  Top 0.406: U1.1 44.38,35.43 v44.61,35.2 | U4.6 65.29,43.66 65.29,38.24 69.22,34.31 72.69,34.31 J6.4
  Bottom 0.406: v44.61,35.2 44.78,35.03 56.97,35.03 61.63,39.7 63.35,39.7 65.29,41.63 65.29,43.66 U4.6
N$1
  Bottom 0.406: LED2.1 38.55,5.65 R5.2
N$2
  Bottom 0.406: LED3.1 51.35,5.64 R6.2
N$4
  Bottom 0.406: LED1.1 25.49,5.66 R4.2
N$8
  Bottom 0.406: J1.3 64.06,15.56 R8.2
N$12
  Top 0.406: R7.2 31.26,52.68 LED4.2
N$16
  Bottom 0.406: U6.7 24.27,19.98 R19.1
NONE
  cutout Top: 35.15,24.52 39.55,24.52 39.55,27.87 39.59,27.91 43.1,27.91 43.14,27.87 43.14,24.72 43.24,24.62 43.31,24.55 45.35,24.55 48.08,21.82 48.18,21.82 48.31,21.69 48.31,14.05 45.38,11.12 45.22,10.96 43.31,10.96 43.21,10.86 43.21,8.03 43.14,7.96 39.85,7.96 39.72,8.09 39.72,10.96 34.88,10.96 34.82,11.02 34.82,24.46 34.88,24.52
  cutout Bottom: 17.62,23.27 21.34,23.27 21.4,23.21 21.4,18.24 21.37,18.21 21.34,18.18 17.81,18.18 17.81,23.2 17.85,23.24
RST  (via drill 0.51)
  Top 0.406: v43.33,33.48 43.38,33.43 R1.1 | U1.4 41.51,37.82 v41.38,37.95 | v57.3,33.45 65.2,33.45 70.75,27.9 74.6,27.9 J6.5
  Bottom 0.406: v41.38,37.95 41.38,35.42 v43.33,33.48 57.27,33.48 v57.3,33.45
SCK  (via drill 0.51)
  Top 0.406: U1.3 40.57,37.03 v40.47,37.13 | v58.88,38.24 v58.89,38.24 58.89,41.39 61.54,44.04 U4.5 62.82,43.59 62.82,39.85 68.61,34.06 69.02,33.65 70.1,32.57 70.1,29.49 70.72,28.86 70.79,28.86 71.14,28.51 72.67,28.51 J6.3
  Bottom 0.406: v40.47,37.13 40.47,38.33 41.01,38.86 42.26,38.86 45.48,35.64 55.85,35.64 58.45,38.24 v58.88,38.24
SCL  (via drill 0.51)
  Top 0.406: U1.19 35.77,45.12 35.77,43.31 v35.33,42.87 | v20.16,22.15 21.03,23.02 v21.03,30.2
  Bottom 0.406: v35.33,42.87 31.08,42.87 22.67,34.46 22.67,31.84 v21.03,30.2 R10.2 | U6.6 21.05,21.25 v20.16,22.15
SDA  (via drill 0.51)
  Top 0.406: v33.77,41.82 34.38,42.42 34.38,43.74 35.02,44.39 U1.20 | v22.54,23.63 23.28,24.37 23.28,30.13 v23.33,30.18
  Bottom 0.406: v33.77,41.82 33.37,42.22 31.4,42.22 23.33,34.15 v23.33,30.18 R9.2
  Bottom 0.508: U6.5 22.23,23.32 v22.54,23.63
VBAT_3V  (via drill 0.51)
  Top 0.508: BH1.+$1 34.96,9.69 30.63,14.02 v30.63,17.52 30.63,21.66 35.06,26.09 BH1.+$2
  Bottom 0.508: v30.63,17.52 20.87,17.52 19.54,18.85 19.54,19.76 18.05,21.25 U6.3
VCC  (via drill 0.51)
  Top 0.406: U1.27 29.85,40.21 C6.1 | U1.17 37.41,46.89 C7.1 | C5.1 36.62,32.03 U1.38 | U1.5 43.9,38.63 44.29,38.24 44.29,38.21 C4.1 45.14,35.97 47.38,33.73 47.38,32.29 45.22,30.13 R1.2 | 55.7,46.33
  Top 1.016: v36.14,49.37 34.4,49.37 29.12,44.09 C6.1 28.55,40.94 27.63,40.02 27.63,32.28 v31.04,28.87 34.36,28.87 35.67,30.18 | C5.1 35.67,30.18 | 35.67,30.18 35.67,29.71 36.46,28.92 42.17,28.92 R1.2 44.48,29.03 50.99,29.03 | C7.1 36.69,48.83 v36.14,49.37 | v36.14,49.37 52.66,49.37 55.7,46.33 55.7,33.71 54.88,32.89 54.85,32.89 50.99,29.03 | 50.99,29.03 v59.94,29.03 65.67,29.03 70.39,24.31 v70.39,16.81
  Bottom 0.406: C8.1 72.22,10.47 U2.3 | R10.1 23.3,26.58 23.3,24.59 23.35,24.54 | C17.1 21.87,24.25 22.16,24.54 23.35,24.54 | 23.35,24.54 24.36,23.53 | R2.1 59.94,25.1 v59.94,29.03
  Bottom 0.508: U6.8 23.36,18.71 | 23.36,18.71 23.37,18.72 | 23.36,18.71 25.59,18.71 26.21,19.34 26.21,23.03 25.7,23.53
  Bottom 1.016: v31.04,28.87 25.7,23.53 24.36,23.53 R19.2 | 23.3,26.58 R9.1 | J9.1 79.98,18.67 78.59,20.07 71.36,20.07 70.39,19.09 v70.39,16.81 70.39,12.3 U2.3
  pour Top: 70.76,11.4 10.64,11.4 10.64,31.6 26.78,31.6 27.1,31.92 27.1,42.44 34.36,49.7 59.04,49.7 59.04,34.23 59.45,33.82 78.52,33.82 78.52,19.67 70.8,19.67
VCC3.3  (via drill 0.51)
  Top 0.762: U5.1 1.45,52.68 v1.38,52.61
  Top 1.016: 61.4,52.71 63.06,51.05 63.06,50.97 U4.2 | 61.4,52.71 35.94,52.71 26.13,42.9 26.13,36.66 22.24,32.77 3.44,32.77 3.44,32.71 | v1.38,52.61 1.38,43.48 1.32,43.42 1.32,34.83 3.44,32.71 | 3.44,32.71 3.44,16.84 10.11,10.17 11.75,10.17 19.67,2.25 63.85,2.25 v74.39,12.79 | C11.2 58.08,56.03 61.4,52.71
  Bottom 0.406: 6.41,51.54 C12.1 | R11.1 62.64,51.39 U4.2 64.08,52.29 C10.1 | C9.1 74.49,10.51 U2.2
  Bottom 0.813: C12.1 2.36,51.63 v1.38,52.61
  Bottom 1.016: R13.2 8.12,38.55 6.14,40.53 6.14,41.26 R16.2 6.32,41.44 R17.2 5.26,43.34 3.93,44.66 3.93,46.96 6.17,49.2 R12.2 6.41,51.54 | v74.39,12.79 74.37,12.77 U2.2 | C13.1 1.43,52.56 v1.38,52.61
  pour Top: 0.83,53.02 66.19,53.02 66.35,52.86 66.35,34.58 59.75,34.58 59.75,50.33 33.96,50.33 26.43,42.8 26.43,32.32 26.44,32.31 10.01,32.31 9.97,32.27 9.97,10.77 10.04,10.7 81.45,10.7 81.45,0.48 0.55,0.48 0.53,0.46 0.53,53.04 0.48,53.09
X1
  Bottom 0.406: U6.1 13.69,18.71 Y2.2 C15.1
X2
  Bottom 0.406: U6.2 13.12,19.98 Y2.1 12.7,20.41 C16.1
XTAL1
  Top 0.406: U1.8 44.45,41.02 Y1.1 47.9,44.47 C1.1
XTAL2
  Top 0.406: U1.7 44.32,40.21 44.43,40.32 47.45,40.32 Y1.3 48.37,41.05 C2.1
ΤΑΒ  (via drill 0.51)
  Bottom 0.254: U2.TAB 74.37,18.64 v74.35,18.65
  Bottom 0.406: U2.TAB 74.64,16.56 v76.89,16.56 | U2.TAB 74.08,16.54 v71.81,16.54 | U2.TAB 74.37,14.89 v74.29,14.81
  pour Bottom (no thermals): 71.22,19.12 77.62,19.12 77.62,13.92 71.22,13.92
ΤΑΒ1
  pour Top (no thermals): 71.22,19.14 77.62,19.14 77.62,13.92 71.22,13.92

### Text on the board
tPlace: 1 | 5V | GND | v1.0